# Altium schematic sheet flipperzero-devboard-stlinkv3.SchDoc
size 431 x 279 mm; SheetNumber: 1; SheetTotal: 1
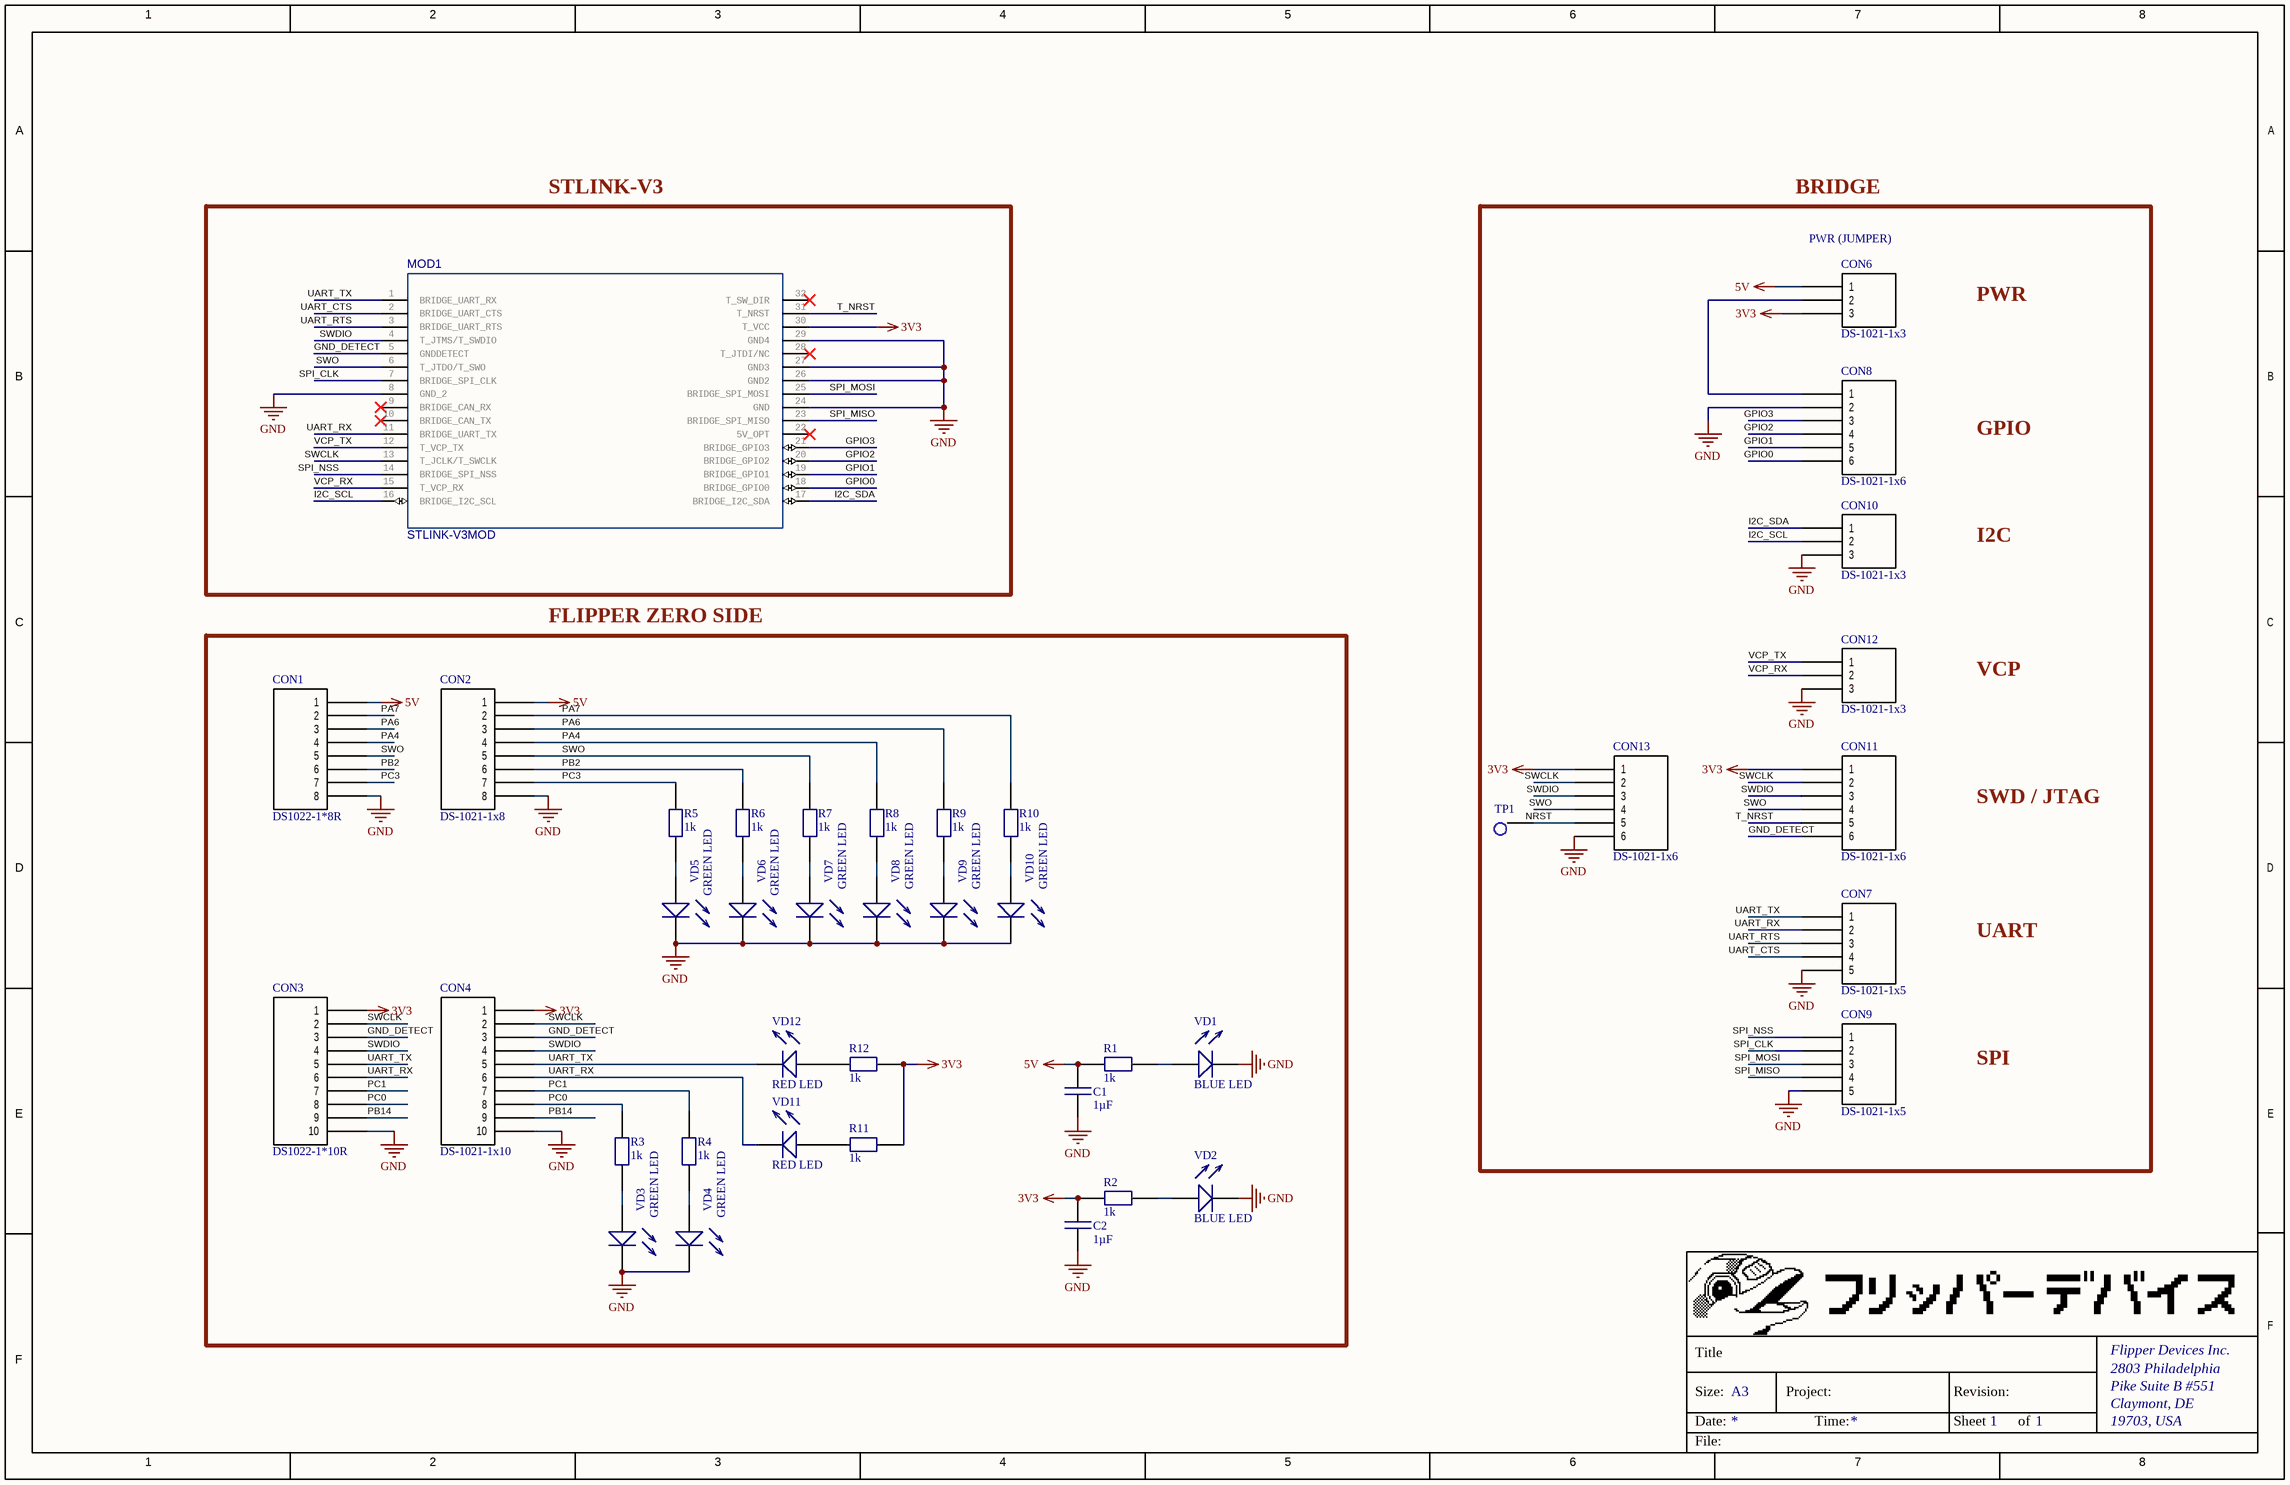
[diagram p0: flipperzero-devboard-stlinkv3.SchDoc]

## Parts
C1  value 1µF  [CAP0603]  (hidden comment: 1uF)
C2  value 1µF  [CAP0603]  (hidden comment: 1uF)
CON1  DS1022-1*8R  [PLS-8R]
CON2  DS-1021-1x8  [PLS-8]
CON3  DS1022-1*10R  [PLS-10R]
CON4  DS-1021-1x10  [PLS-10]
CON6  DS-1021-1x3  [PLS-3]
CON7  DS-1021-1x5  [PLS-5]
CON8  DS-1021-1x6  [PLS-6]
CON9  DS-1021-1x5  [PLS-5]
CON10  DS-1021-1x3  [PLS-3]
CON11  DS-1021-1x6  [PLS-6]
CON12  DS-1021-1x3  [PLS-3]
CON13  DS-1021-1x6  [PLS-6]
MOD1  STLINK-V3MOD  [STLINK-V3MOD]
R1  1K  [RESC1608X55X25ML10T15]
R2  1K  [RESC1608X55X25ML10T15]
R3  1K  [RESC1608X55X25ML10T15]
R4  1K  [RESC1608X55X25ML10T15]
R5  1K  [RESC1608X55X25ML10T15]
R6  1K  [RESC1608X55X25ML10T15]
R7  1K  [RESC1608X55X25ML10T15]
R8  1K  [RESC1608X55X25ML10T15]
R9  1K  [RESC1608X55X25ML10T15]
R10  1K  [RESC1608X55X25ML10T15]
R11  1K  [RESC1608X55X25ML10T15]
R12  1K  [RESC1608X55X25ML10T15]
TP1  Control_point  [control point_1mm]  (value not drawn)  (no BOM)
VD1  BLUE LED  [LED 0603]
VD2  BLUE LED  [LED 0603]
VD3  GREEN LED  [LED 0603]
VD4  GREEN LED  [LED 0603]
VD5  GREEN LED  [LED 0603]
VD6  GREEN LED  [LED 0603]
VD7  GREEN LED  [LED 0603]
VD8  GREEN LED  [LED 0603]
VD9  GREEN LED  [LED 0603]
VD10  GREEN LED  [LED 0603]
VD11  RED LED  [LED 0603]
VD12  RED LED  [LED 0603]

## Blocks framed on the sheet
STLINK-V3: MOD1
FLIPPER ZERO SIDE: C1 C2 CON1-CON4 R1-R12 VD1-VD12

## Nets
3V3: C2.2 CON3.1 CON4.1 CON6.3 CON11.1 CON13.1 MOD1.30(T_VCC) R2.1 R11.2 R12.2
5V: C1.2 CON1.1 CON2.1 CON6.1 R1.1
GND: C1.1 C2.1 CON1.8 CON2.8 CON3.10 CON4.10 CON7.5 CON8.2 CON9.5 CON10.3 CON12.3 CON13.6 MOD1.8(GND_2) MOD1.24(GND) MOD1.26(GND2) MOD1.27(GND3) MOD1.29(GND4) VD1.1 VD2.1 VD3.1 VD4.1 VD5.1 VD6.1 VD7.1 VD8.1 VD9.1 VD10.1
GND_DETECT: CON3.3 CON4.3 CON11.6 MOD1.5(GNDDETECT)
GPIO0: CON8.6 MOD1.18(BRIDGE_GPIO0)
GPIO1: CON8.5 MOD1.19(BRIDGE_GPIO1)
GPIO2: CON8.4 MOD1.20(BRIDGE_GPIO2)
GPIO3: CON8.3 MOD1.21(BRIDGE_GPIO3)
I2C_SCL: CON10.2 MOD1.16(BRIDGE_I2C_SCL)
I2C_SDA: CON10.1 MOD1.17(BRIDGE_I2C_SDA)
NRST: CON13.5 TP1.1
PA4: CON1.4 CON2.4 R8.1
PA6: CON1.3 CON2.3 R9.1
PA7: CON1.2 CON2.2 R10.1
PB2: CON1.6 CON2.6 R6.1
PB14: CON3.9 CON4.9
PC0: CON3.8 CON4.8 R3.1
PC1: CON3.7 CON4.7 R4.1
PC3: CON1.7 CON2.7 R5.1
SPI_CLK: CON9.2 MOD1.7(BRIDGE_SPI_CLK)
SPI_MISO: CON9.4 MOD1.23(BRIDGE_SPI_MISO)
SPI_MOSI: CON9.3 MOD1.25(BRIDGE_SPI_MOSI)
SPI_NSS: CON9.1 MOD1.14(BRIDGE_SPI_NSS)
SWCLK: CON3.2 CON4.2 CON11.2 CON13.2 MOD1.13(T_JCLK/T_SWCLK)
SWDIO: CON3.4 CON4.4 CON11.3 CON13.3 MOD1.4(T_JTMS/T_SWDIO)
SWO: CON1.5 CON2.5 CON11.4 CON13.4 MOD1.6(T_JTDO/T_SWO) R7.1
T_NRST: CON11.5 MOD1.31(T_NRST)
UART_CTS: CON7.4 MOD1.2(BRIDGE_UART_CTS)
UART_RTS: CON7.3 MOD1.3(BRIDGE_UART_RTS)
UART_RX: CON3.6 CON4.6 CON7.2 MOD1.11(BRIDGE_UART_TX) VD11.1
UART_TX: CON3.5 CON4.5 CON7.1 MOD1.1(BRIDGE_UART_RX) VD12.1
VCP_RX: CON12.2 MOD1.15(T_VCP_RX)
VCP_TX: CON12.1 MOD1.12(T_VCP_TX)
NetCON6_2: CON6.2 CON8.1
NetR1_2: R1.2 VD1.2
NetR2_2: R2.2 VD2.2
NetR3_2: R3.2 VD3.2
NetR4_2: R4.2 VD4.2
NetR5_2: R5.2 VD5.2
NetR6_2: R6.2 VD6.2
NetR7_2: R7.2 VD7.2
NetR8_2: R8.2 VD8.2
NetR9_2: R9.2 VD9.2
NetR10_2: R10.2 VD10.2
NetR11_1: R11.1 VD11.2
NetR12_1: R12.1 VD12.2

Not connected (* = marked no-connect by the designer): MOD1 9(BRIDGE_CAN_RX)* 10(BRIDGE_CAN_TX)* 22(5V_OPT)* 28(T_JTDI/NC)* 32(T_SW_DIR)*

## Notes on the sheet
- BRIDGE
- (near CON6) PWR (JUMPER)
- PWR
- GPIO
- I2C
- VCP
- SWD / JTAG
- UART
- SPI
- 1
- 2
- 3
- 4
- 5
- 6
- 7
- 8
- A
- B
- C
- D
- E
- F
- Title
- 2803 Philadelphia
- Flipper Devices Inc.
- Size:
- Date:
- A3
- Project:
- Time:
- Revision:
- Sheet
- of
- 19703, USA
- Claymont, DE
- Pike Suite B #551
- File:

## Library data of the parts
C1 C2 = CMP-001-00097-2: Chip Capacitor; Tolerance: 10%; Internal_PN: FDCAP0016; Dielectric: X5R; Voltage: 16V; Company: Flipper Devices; Component Type: Standard; Case: 0603; Pins: 2; Design Item ID: CAP_1uF_0603; Source: Flipper_zero.SchLib; Case/Package: 0603
CON1 = CMP-003-000005-6: Connector 2.54mm 1х8 Angular Type; Internal_PN: FDCON0014; Company: Flipper Zero; Source: MIDI.SchLib; Component Type: Standard; Design Item ID: DS-1022-1x8; Pin Count: 8
CON2 = CMP-003-000065-2: Connector 2.54mm 1х8 Straight Type; Company: Flipper Zero; Internal_PN: FDCON0016; Source: MIDI.SchLib; Component Type: Standard; Design Item ID: DS-1021-1x8; Pin Count: 8
CON3 = CMP-003-000004-6: Connector 2.54mm 1х10 Angular Type; Internal_PN: FDCON0015; Company: Flipper Zero; Design Item ID: DS-1022-1x10; Source: MIDI.SchLib; Component Type: Standard; Pin Count: 10
CON4 = CMP-003-000066-2: Connector 2.54mm 1х10 Straight Type; Internal_PN: FDCON0017; Company: Flipper Zero; Component Type: Standard; Source: MIDI.SchLib; Pin Count: 10; Design Item ID: DS-1021-1x10
CON6 CON10 CON12 = CMP-003-000069-1: Connector 2.54mm 1х3 Straight Type; Internal_PN: FDCON0018; Company: Flipper Zero; Design Item ID: DS-1021-1x3; Component Type: Standard; Source: MIDI.SchLib; Pin Count: 3
CON7 CON9 = CMP-003-000071-1: Connector 2.54mm 1х5 Straight Type; Company: Flipper Zero; Internal_PN: FDCON0020; Design Item ID: DS-1021-1x5; Pin Count: 4; Source: MIDI.SchLib; Component Type: Standard
CON8 CON11 CON13 = CMP-003-000072-1: Connector 2.54mm 1х6 Straight Type; Internal_PN: FDCON0021; Company: Flipper Zero; Source: MIDI.SchLib; Pin Count: 6; Design Item ID: DS-1021-1x6; Component Type: Standard
MOD1 = CMP-00030-00002-3: STLINK-V3 Compact In-Circuit Debugger and Programmer for STM32 Microcontroller; Company: Flipper Devices; Internal_PN: FDMOD0002; Pins: 32
R1-R12 = CMP-009-00014-6: Chip Resistor, 1 KOhm, +/-5%, 0.1 W, -55 to 155 degC, 0603 (1608 Metric); Voltage Rating: 50V; Internal_PN: FDRES0034; Power: 100mW; Company: Flipper Devices; Tolerance: 5%; Value: 1k; Case/Package: 0603; Pins: 2; RoHS Compliant: True; Mounting Technology: SM
TP1 = CMP-016-000010-5: Testpoint; Company: Flipper Devices; Pin Count: 1; Source: Flipper_zero.SchLib; Component Type: Standard (No BOM); Design Item ID: control point; ClassName: Testpoint
VD1 VD2 = CMP-003-000068-1: LED; Company: Flipper Devices; Internal_PN: FDDIO0008; Source: Flipper_zero.SchLib; Pin Count: 2; Case/Package: 0603; Case: SMD/SMT; Component Type: Standard
VD3-VD10 = CMP-003-000068-1: LED; Company: Flipper Devices; Internal_PN: FDDIO0009; Source: Flipper_zero.SchLib; Pin Count: 2; Case/Package: 0603; Case: SMD/SMT; Component Type: Standard
VD11 VD12 = CMP-003-000068-1: LED; Company: Flipper Devices; Internal_PN: FDDIO0010; Source: Flipper_zero.SchLib; Pin Count: 2; Case/Package: 0603; Case: SMD/SMT; Component Type: Standard